# EAGLE design SDLogger (EAGLE 5.10)
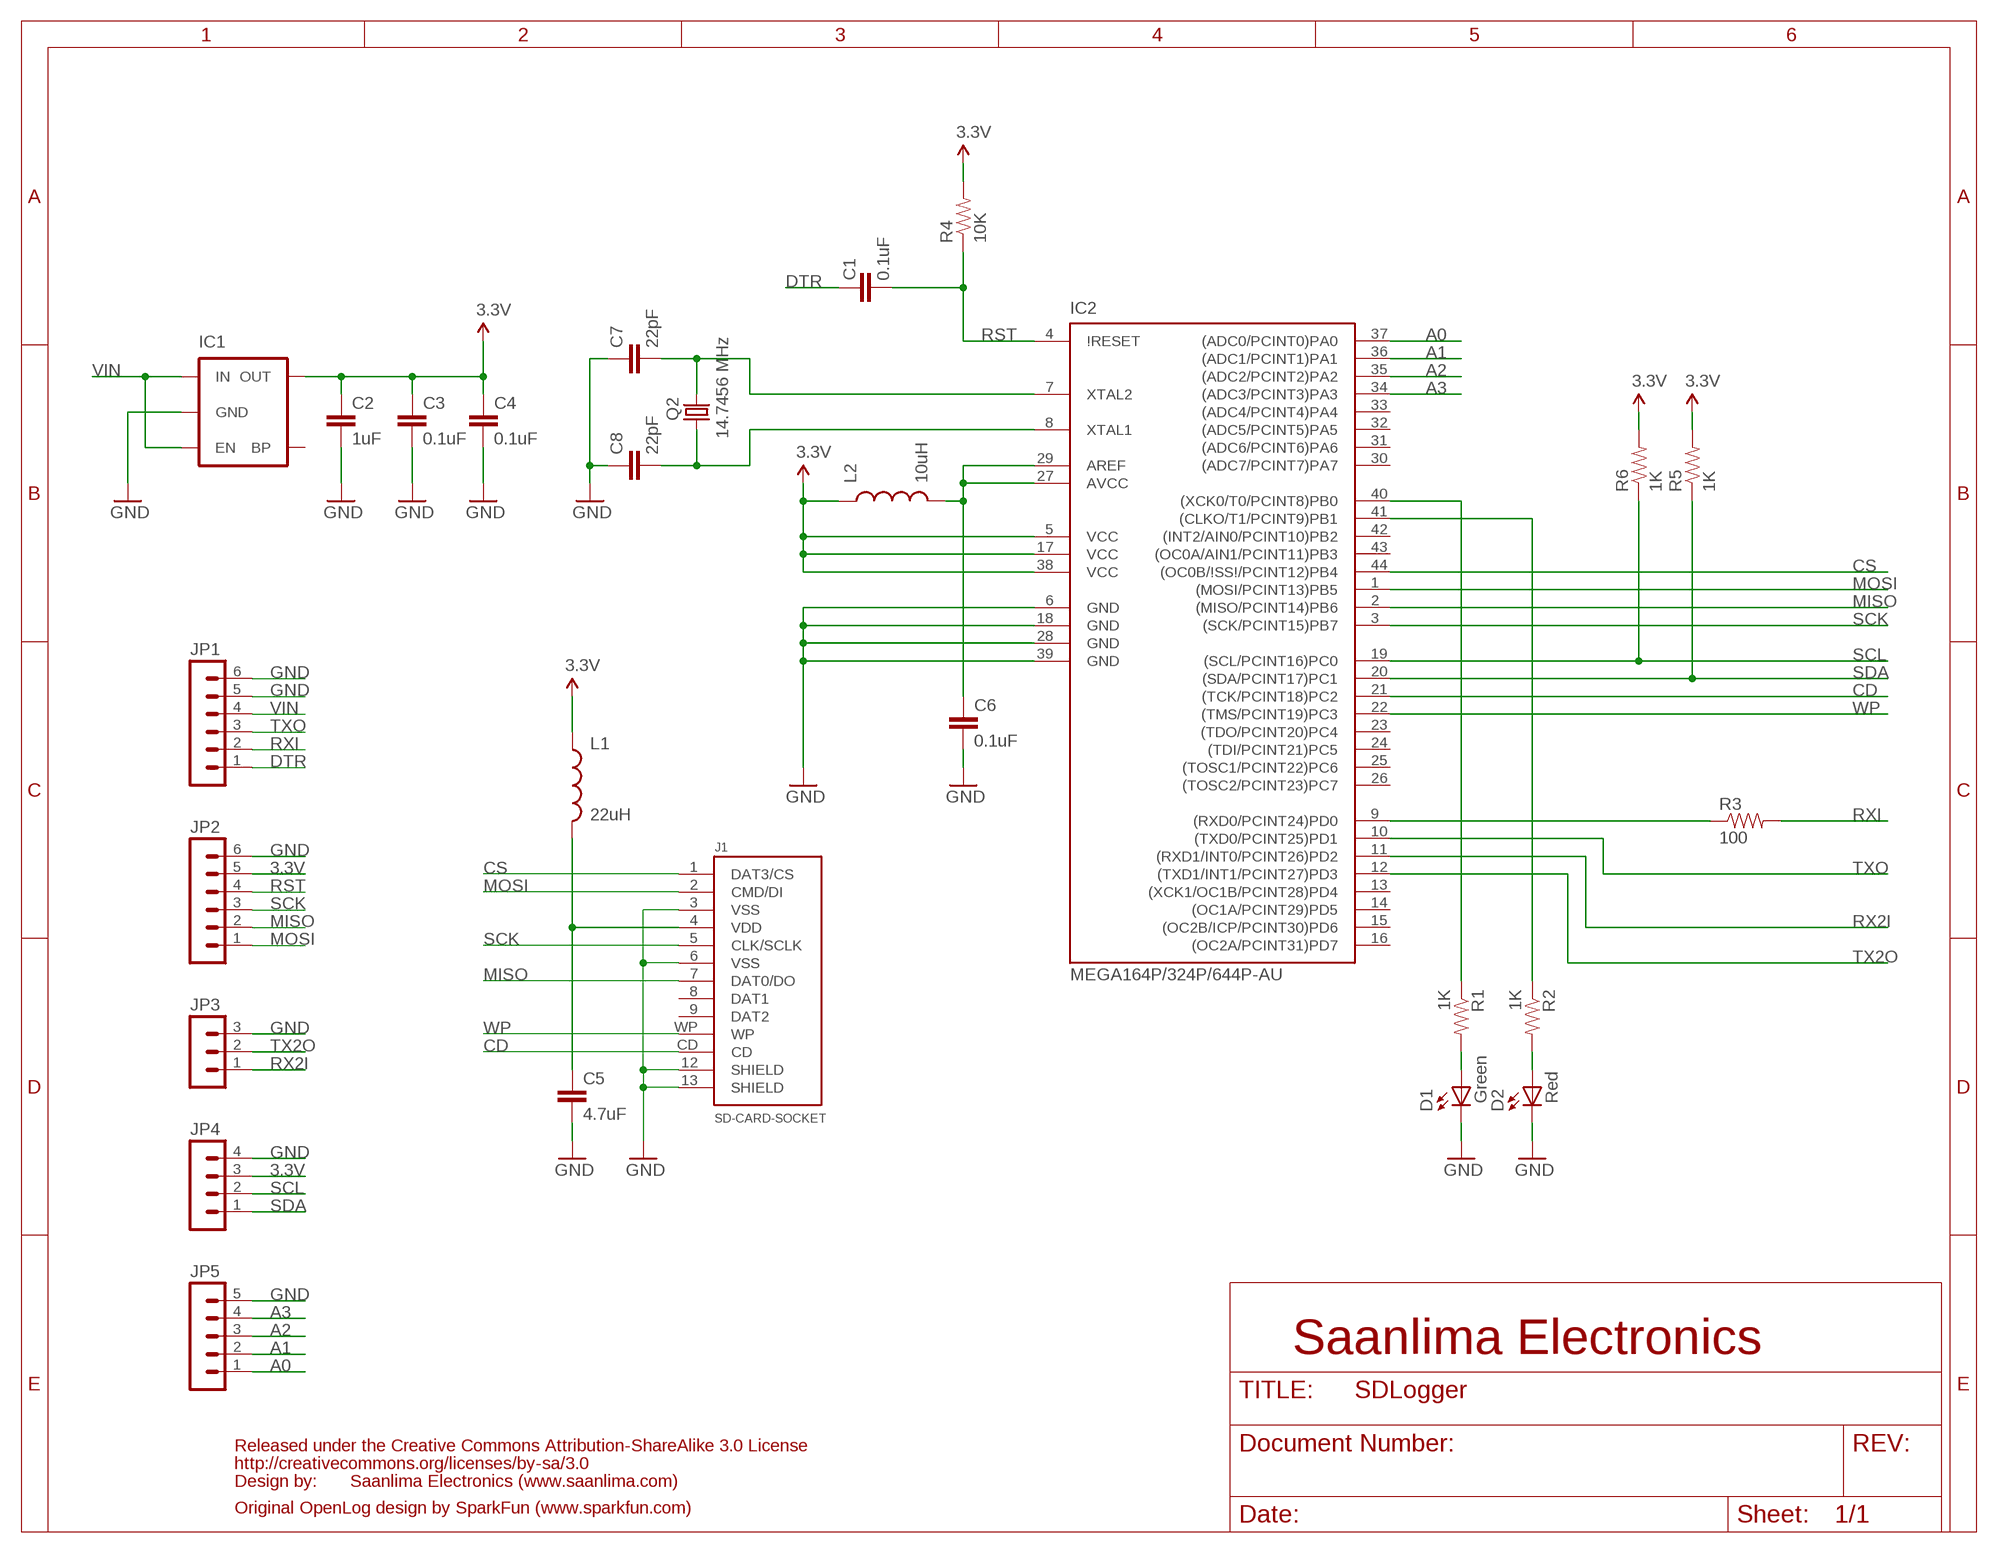
[diagram p0: schematic, sheet 1]

## Parts
C1  0.1uF  CAP0402  [CAP-0402]
C2  1uF  CAP0402  [CAP-0402]
C3  0.1uF  CAP0402  [CAP-0402]
C4  0.1uF  CAP0402  [CAP-0402]
C5  4.7uF  CAP0402  [CAP-0402]
C6  0.1uF  CAP0402  [CAP-0402]
C7  22pF  CAP0402  [CAP-0402]
C8  22pF  CAP0402  [CAP-0402]
D1  Green  LEDCHIPLED_0805  [CHIPLED_0805]
D2  Red  LEDCHIPLED_0805  [CHIPLED_0805]
IC1  3.3V MIC5205  MIC5205SMD  [SOT23-5]
IC2  MEGA164P/324P/644P-AU  [TQFP44]
J1  SD-CARD-SOCKET  [SD-MMC_SOCKET-3M]
JP1  MA06-1  [MA06-1]
JP2  MA06-1  [MA06-1]
JP3  MA03-1  [MA03-1]
JP4  MA04-1  [MA04-1]
JP5  MA05-1  [MA05-1]
L1  22uH  INDUCTOR0805  [IND-0805]
L2  10uH  INDUCTOR0805  [IND-0805]
Q2  14.7456 MHz  CRYSTAL5X3  [CRYSTAL-SMD-5X3]
R1  1K  RESISTOR0402  [RES-0402]
R2  1K  RESISTOR0402  [RES-0402]
R3  100  RESISTOR0402  [RES-0402]
R4  10K  RESISTOR0402  [RES-0402]
R5  1K  RESISTOR0402  [RES-0402]
R6  1K  RESISTOR0402  [RES-0402]
U$1  CC-BY-SA  [CC-BY-SA]

## Nets
3.3V: C2.1 C3.1 C4.1 IC1.5(OUT) IC2.5(VCC) IC2.17(VCC) IC2.38(VCC) JP2.5 JP4.3 L1.1 L2.1 R4.2 R5.2 R6.2
A0: IC2.37((ADC0/PCINT0)PA0) JP5.1
A1: IC2.36((ADC1/PCINT1)PA1) JP5.2
A2: IC2.35((ADC2/PCINT2)PA2) JP5.3
A3: IC2.34((ADC3/PCINT3)PA3) JP5.4
CD: IC2.21((TCK/PCINT18)PC2) J1.CD
CS: IC2.44((OC0B/\!SS\!/PCINT12)PB4) J1.1(DAT3/CS)
DTR: C1.2 JP1.1
GND [vcc]: C2.2 C3.2 C4.2 C5.2 C6.2 C7.1 C8.1 D1.C D2.C IC1.2(GND) IC2.6(GND) IC2.18(GND) IC2.28(GND) IC2.39(GND) J1.3(VSS) J1.6(VSS) J1.12(SHIELD) J1.13(SHIELD) JP1.5 JP1.6 JP2.6 JP3.3 JP4.4 JP5.5
MISO: IC2.2((MISO/PCINT14)PB6) J1.7(DAT0/DO) JP2.2
MOSI: IC2.1((MOSI/PCINT13)PB5) J1.2(CMD/DI) JP2.1
N$1: IC2.9((RXD0/PCINT24)PD0) R3.1
N$2: C8.2 IC2.8(XTAL1) Q2.1
N$3: D1.A R1.2
N$4: IC2.41((CLKO/T1/PCINT9)PB1) R2.1
N$5: IC2.40((XCK0/T0/PCINT8)PB0) R1.1
N$6: C5.1 J1.4(VDD) L1.2
N$7: D2.A R2.2
N$8: C7.2 IC2.7(XTAL2) Q2.3
N$9: C6.1 IC2.27(AVCC) IC2.29(AREF) L2.2
RST: C1.1 IC2.4(\!RESET) JP2.4 R4.1
RX2I: IC2.11((RXD1/INT0/PCINT26)PD2) JP3.1
RXI: JP1.2 R3.2
SCK: IC2.3((SCK/PCINT15)PB7) J1.5(CLK/SCLK) JP2.3
SCL: IC2.19((SCL/PCINT16)PC0) JP4.2 R6.1
SDA: IC2.20((SDA/PCINT17)PC1) JP4.1 R5.1
TX2O: IC2.12((TXD1/INT1/PCINT27)PD3) JP3.2
TXO: IC2.10((TXD0/PCINT25)PD1) JP1.3
VIN [vcc]: IC1.1(IN) IC1.3(EN) JP1.4
WP: IC2.22((TMS/PCINT19)PC3) J1.WP
Unconnected: IC1.4(BP) IC2.13((XCK1/OC1B/PCINT28)PD4) IC2.14((OC1A/PCINT29)PD5) IC2.15((OC2B/ICP/PCINT30)PD6) IC2.16((OC2A/PCINT31)PD7) IC2.23((TDO/PCINT20)PC4) IC2.24((TDI/PCINT21)PC5) IC2.25((TOSC1/PCINT22)PC6) IC2.26((TOSC2/PCINT23)PC7) IC2.30((ADC7/PCINT7)PA7) IC2.31((ADC6/PCINT6)PA6) IC2.32((ADC5/PCINT5)PA5) IC2.33((ADC4/PCINT4)PA4) IC2.42((INT2/AIN0/PCINT10)PB2) IC2.43((OC0A/AIN1/PCINT11)PB3) J1.8(DAT1) J1.9(DAT2)

## Notes on the sheet
- Saanlima Electronics
- Saanlima Electronics (www.saanlima.com)
- Original OpenLog design by SparkFun (www.sparkfun.com)

## Library data of the parts
C1-C8 = rsr:CAP
D1 D2 = led:LED: LED OSRAM: - CHIPLED LG R971, LG N971, LY N971, LG Q971, LY Q971, LO R971, LY R971 LH N974, LH R974 LS Q976, LO Q976, LY Q976 LO Q996 - Hyper CHIPLED LW Q18S LB Q993, LB Q99A, LB R99A - SideLED LS A670, LO A670, LY A670, LG A670, LP A670 LB A673, LV A673, LT A673, LW A673 LH A674 LY A675 LS A676, LA A676, LO A676, LY A676, LW A676 LS A679, LY A679, LG A679 - Hyper Micro SIDELED® LS Y876, LA Y876, LO Y876, LY Y876 LT Y87S - SmartLED LW L88C, LW L88S LB L89C, LB L89S, LG L890 LS L89K, LO L89K, LY L89K LS L896, LA L896, LO L896, LY L896 - TOPLED LS T670, LO T670, LY T670, LG T670, LP T670 LSG T670, LSP T670, LSY T670, LOP T670, LYG T670 LG T671, LOG T671, LSG T671 LB T673, LV T673, LT T673, LW T673 LH T674 LS T676, LA T676, LO T676, LY T676, LB T676, LH T676, LSB T676, LW T676 LB T67C, LV T67C, LT T67C, LS T67K, LO T67K, LY T67K, LW E67C LS E67B, LA E67B, LO E67B, LY E67B, LB E67C, LV E67C, LT E67C LW T67C LS T679, LY T679, LG T679 LS T770, LO T770, LY T770, LG T770, LP T770 LB T773, LV T773, LT T773, LW T773 LH T774 LS E675, LA E675, LY E675, LS T675 LS T776, LA T776, LO T776, LY T776, LB T776 LHGB T686 LT T68C, LB T68C - Hyper Mini TOPLED® LB M676 - Mini TOPLED Santana® LG M470 LS M47K, LO M47K, LY M47K Source: http://www.osram.convergy.de LUXEON: - LUMILED® LXK2-PW12-R00, LXK2-PW12-S00, LXK2-PW14-U00, LXK2-PW14-V00 LXK2-PM12-R00, LXK2-PM12-S00, LXK2-PM14-U00 LXK2-PE12-Q00, LXK2-PE12-R00, LXK2-PE12-S00, LXK2-PE14-T00, LXK2-PE14-U00 LXK2-PB12-K00, LXK2-PB12-L00, LXK2-PB12-M00, LXK2-PB14-N00, LXK2-PB14-P00, LXK2-PB14-Q00 LXK2-PR12-L00, LXK2-PR12-M00, LXK2-PR14-Q00, LXK2-PR14-R00 LXK2-PD12-Q00, LXK2-PD12-R00, LXK2-PD12-S00 LXK2-PH12-R00, LXK2-PH12-S00 LXK2-PL12-P00, LXK2-PL12-Q00, LXK2-PL12-R00 Source: www.luxeon.com KINGBRIGHT: KA-3528ASYC Source: www.kingbright.com
IC1 = rsr:MIC5205: Micrel MIC5205.
IC2 = rsr:MEGA164P/324P/644P-AU
J1 = rsr:SD-CARD-SOCKET
JP1 JP2 = rsr:MA06-1: PIN HEADER
JP3 = rsr:MA03-1: PIN HEADER
JP4 = rsr:MA04-1: PIN HEADER
JP5 = rsr:MA05-1: PIN HEADER
L1 L2 = rsr:INDUCTOR
Q2 = rsr:CRYSTAL
R1-R6 = rsr:RESISTOR
U$1 = rsr:CC-BY-SA

## Net classes
0 default: width 0.178 mm
1 vcc: width 0.203 mm

## Board
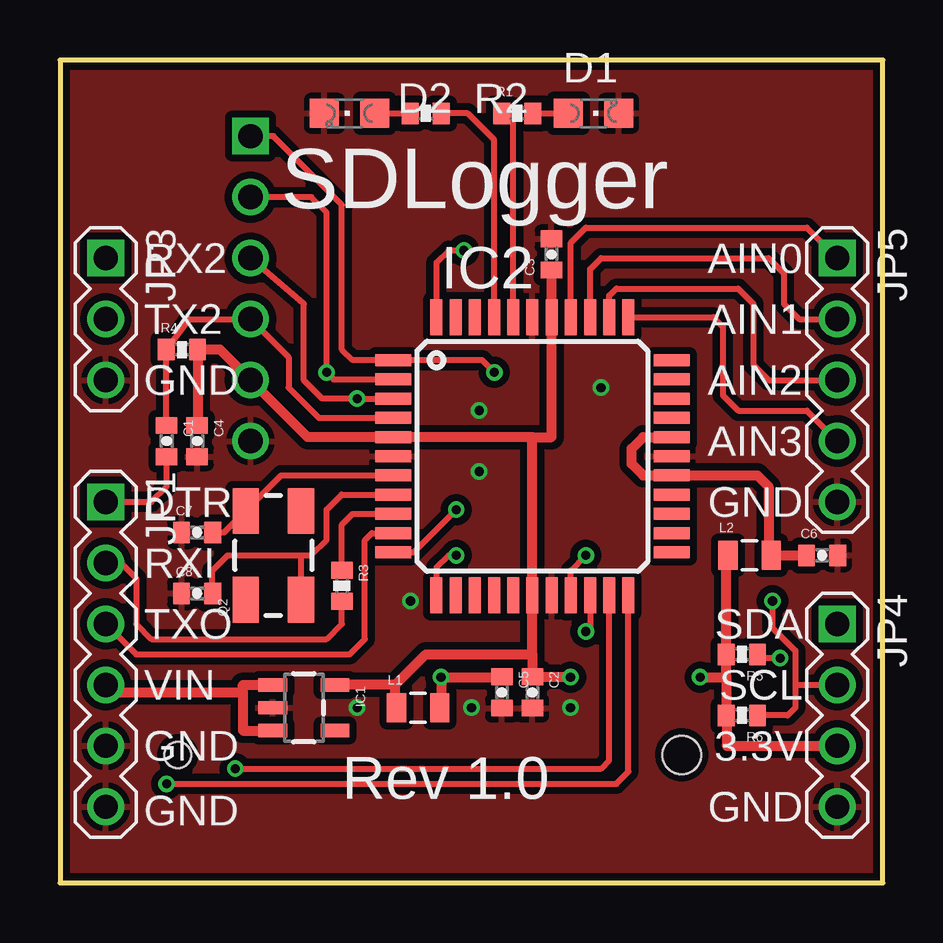
[diagram p1: board, top side]
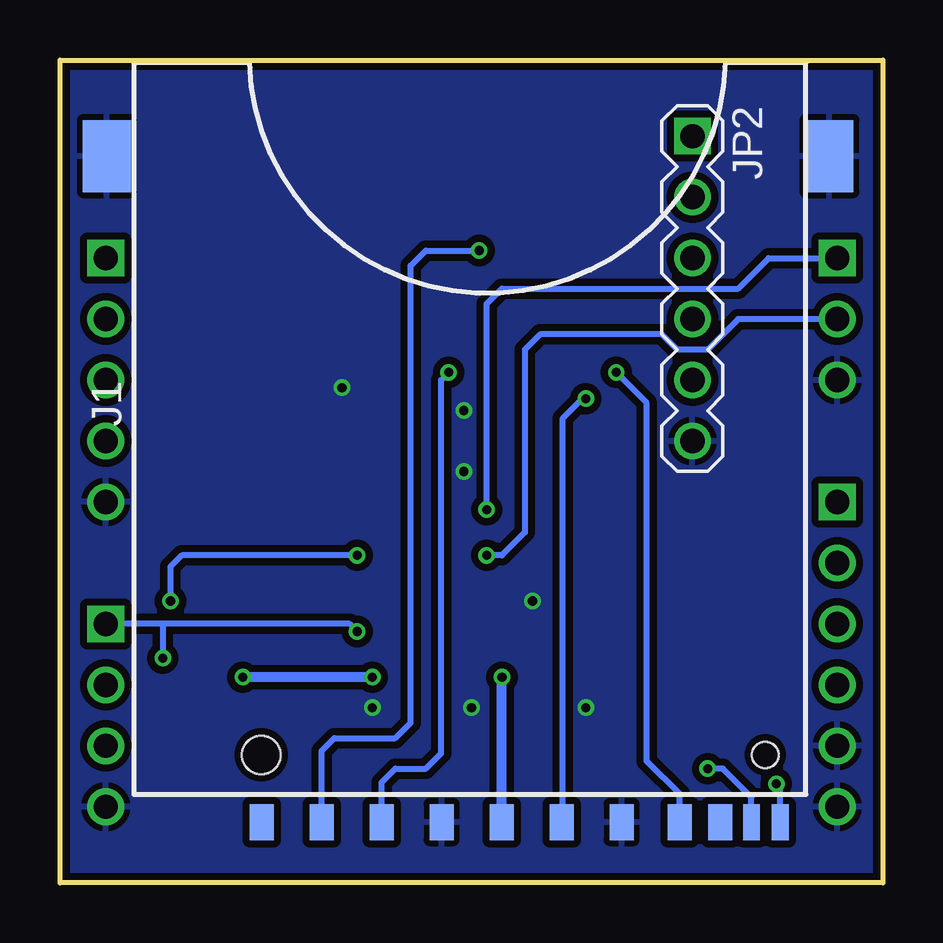
[diagram p2: board, bottom side, seen from below]

Size 34.29 x 34.29 mm. Coordinates in mm from the lower left corner, seen from the top.
Outline: 34.29,0 34.29,34.29 0,34.29 0,0 34.29,0
Copper layers (1*16): Top 0.035mm / dielectric 1.5mm / Bottom 0.035mm
Design rules "Fusion_eagle_rule_v1.1": minimum track width 6mil, minimum drill 12mil, track to track 6mil, track to pad 6mil, pad to pad 6mil, via to via 6mil, smd to smd 0mil, copper to edge 10mil, drill to drill 10mil, minimum pad ring 10mil, minimum via ring 6mil, stop-mask expansion 2mil, vias tented up to drill 100mil, thermal gap 10mil

### Footprints (pad centres in the part's own frame; a part is rotated, then mirrored left to right if it is on the bottom)
CAP-0402 = smd 0.7 x 0.9: 1 -0.65,0; 2 0.65,0
CHIPLED_0805 = smd 1.2 x 1.2: A 0,-1.05; C 0,1.05
SOT23-5 = smd 0.55 x 1.2: 1 -0.95,-1.3; 2 0,-1.3; 3 0.95,-1.3; 4 0.95,1.3; 5 -0.95,1.3
TQFP44 = smd 1.5 x 0.5: 1 -5.8,4; 2 -5.8,3.2; 3 -5.8,2.4; 4 -5.8,1.6; 5 -5.8,0.8; 6 -5.8,0; 7 -5.8,-0.8; 8 -5.8,-1.6; 9 -5.8,-2.4; 10 -5.8,-3.2; 11 -5.8,-4; 23 5.8,-4; 24 5.8,-3.2; 25 5.8,-2.4; 26 5.8,-1.6; 27 5.8,-0.8; 28 5.8,0; 29 5.8,0.8; 30 5.8,1.6; 31 5.8,2.4; 32 5.8,3.2; 33 5.8,4 | smd 0.5 x 1.5: 12 -4,-5.8; 13 -3.2,-5.8; 14 -2.4,-5.8; 15 -1.6,-5.8; 16 -0.8,-5.8; 17 0,-5.8; 18 0.8,-5.8; 19 1.6,-5.8; 20 2.4,-5.8; 21 3.2,-5.8; 22 4,-5.8; 34 4,5.8; 35 3.2,5.8; 36 2.4,5.8; 37 1.6,5.8; 38 0.8,5.8; 39 0,5.8; 40 -0.8,5.8; 41 -1.6,5.8; 42 -2.4,5.8; 43 -3.2,5.8; 44 -4,5.8
SD-MMC_SOCKET-3M = smd 1 x 1.5: 1 6.88,29.85; 2 4.38,29.85; 3 1.88,29.85; 4 -0.62,29.85; 5 -3.12,29.85; 6 -5.62,29.85; 7 -8.04,29.85; 8 -9.728,29.85; 9 9.38,29.85 | smd 2 x 3: 12 -14.28,2.1; 13 15.822,2.095 | smd 0.7 x 1.5: CD -11.03,29.855; WP -12.23,29.85 | hole 1.1: -11.6,27.05 | hole 1.6: 9.4,27.05
MA06-1 = drill 1.016 square: 1 0,0 | drill 1.016 round: 2 2.54,0; 3 5.08,0; 4 7.62,0; 5 10.16,0; 6 12.7,0
MA03-1 = drill 1.016 square: 1 0,0 | drill 1.016 round: 2 2.54,0; 3 5.08,0
MA04-1 = drill 1.016 square: 1 0,0 | drill 1.016 round: 2 2.54,0; 3 5.08,0; 4 7.62,0
MA05-1 = drill 1.016 square: 1 0,0 | drill 1.016 round: 2 2.54,0; 3 5.08,0; 4 7.62,0; 5 10.16,0
IND-0805 = smd 0.8 x 1.2: 1 -0.9,0; 2 0.9,0
CRYSTAL-SMD-5X3 = smd 1.9 x 1.1: 1 -1.85,-1.15; 2 1.85,-1.15; 3 1.85,1.15; 4 -1.85,1.15
RES-0402 = smd 0.7 x 0.9: 1 -0.65,0; 2 0.65,0

### Placement (x,y rotation side)
C1  4.45,18.41 270 top
C2  19.68,7.94 270 top
C3  20.48,26.19 90 top
C4  5.71,18.41 270 top
C5  18.41,7.94 270 top
C6  31.75,13.65 0 top
C7  5.71,14.61 0 top
C8  5.71,12.06 0 top
D1  22.23,32.07 270 top
D2  12.06,32.07 90 top
IC1  10.16,7.3 270 top
IC2  19.68,17.78 0 top
J1  16.51,32.38 180 bottom
JP1  1.91,15.88 270 top
JP2  7.94,31.11 270 bottom
JP3  1.91,26.04 270 top
JP4  32.38,10.79 270 top
JP5  32.38,26.04 270 top
L1  14.92,7.3 0 top
L2  28.73,13.65 0 top
Q2  8.89,13.65 90 top
R1  19.05,32.07 0 top
R2  15.24,32.07 180 top
R3  11.75,12.38 270 top
R4  5.08,22.23 0 top
R5  28.42,9.53 180 top
R6  28.42,6.99 180 top
U$1  -12.7,-6.35 0 top  (outside the outline)

### Tracks (layer width: path | path; a pad name or v marks a point on that pad's centre or on a via)
3.3V  (via drill 0.38)
  Top 0.254: 21.26,8.59 v21.27,8.57
  Top 0.406: 13.97,8.25 IC1.5 | 13.97,8.25 15.24,9.53 19.68,9.53 | 19.68,18.58 IC2.5 10.31,18.58 JP2.5 6.67,22.23 R4.2 5.73,19.08 C4.1 | 19.68,18.58 20.48,18.58 IC2.38 20.48,25.26 C3.1 | 19.68,18.58 IC2.17 19.68,9.53 | 21.26,8.59 C2.1 19.68,9.53 | L1.1 13.97,7.36 13.97,8.25 | JP4.3 27.78,5.71 R6.2 27.77,8.57 | 27.77,8.57 R5.2 | R5.2 | R5.2 27.77,13.65 L2.1 | v26.67,8.57 27.77,8.57
  Bottom 0.406: v21.27,8.57 v26.67,8.57
A0
  Top 0.254: IC2.37 21.29,26.68 21.91,27.3 31.11,27.3 JP5.1
A1
  Top 0.254: IC2.36 22.09,25.58 22.54,26.04 29.53,26.04 30.16,25.4 30.16,24.13 30.8,23.5 JP5.2
A2
  Top 0.254: IC2.35 22.89,24.47 23.18,24.77 28.26,24.77 28.89,24.13 28.89,21.59 29.53,20.95 JP5.3
A3
  Top 0.254: IC2.34 27.22,23.58 27.62,23.18 27.62,20.32 28.26,19.68 31.11,19.68 JP5.4
CD  (via drill 0.38)
  Top 0.254: IC2.21 22.89,5.11 22.54,4.76 v7.3,4.76
  Bottom 0.254: J1.CD 5.48,3.58 6.67,4.76 v7.3,4.76
CS  (via drill 0.38)
  Top 0.254: IC2.44 15.69,25.84 16.19,26.35 v16.83,26.35
  Bottom 0.254: v16.83,26.35 19.05,26.35 19.68,25.72 19.68,6.67 20.32,6.03 22.86,6.03 23.39,5.5 J1.1
DTR
  Top 0.254: JP1.1 3.81,15.88 4.45,16.51 C1.2
GND  (via drill 0.38)
  other vias: 22.54,20.64 17.14,7.3 12.38,7.3 17.46,19.68 21.27,7.3 14.61,11.75 17.46,17.14
  pour Top (isolate 0.305): 34.29,0 0,0 0,34.29 34.29,34.29
  pour Bottom (isolate 0.305): 34.29,0 0,0 0,34.29 34.29,34.29
MISO  (via drill 0.38)
  Top 0.254: JP2.2 10.48,28.57 11.11,27.94 v11.11,21.27 11.4,20.98 IC2.2
  Bottom 0.254: J1.7 8.47,3.71 9.84,5.08 9.84,20 v11.11,21.27
MOSI  (via drill 0.38)
  Top 0.254: v18.1,21.27 17.59,21.78 IC2.1 12.19,21.78 11.75,22.23 11.75,28.26 8.89,31.11 JP2.1
  Bottom 0.254: v18.1,21.27 18.41,20.95 18.41,5.4 19.05,4.76 20.32,4.76 20.89,4.19 J1.2
N$1
  Top 0.254: IC2.9 12.21,15.38 11.75,14.92 R3.1
N$2
  Top 0.254: IC2.8 11.73,16.18 11.11,15.56 11.11,14.29 10.48,13.65 10.04,13.65 | C8.2 6.35,12.08 6.35,13.02 6.99,13.65 10.04,13.65 | 10.36,12.5 Q2.1 10.04,13.65
N$3
  Top 0.254: R1.2 D1.A
N$4
  Top 0.254: IC2.41 18.09,30.97 16.99,32.07 R2.1
N$5
  Top 0.254: IC2.40 18.89,31.59 18.73,32.07 R1.1
N$6  (via drill 0.38)
  Top 0.254: 18.1,8.57 C5.1
  Top 0.406: L1.2 15.88,7.3 v15.88,8.57 18.1,8.57
  Bottom 0.254: v15.89,8.57 v15.88,8.57
  Bottom 0.406: J1.4 v15.89,8.57
N$7
  Top 0.203: D2.A 13.34,32.07
  Top 0.254: 13.34,32.07 R2.2
N$8
  Top 0.254: Q2.3 7.9,15.82 | IC2.7 9.22,16.98 Q2.3 | C7.2 6.84,14.61 Q2.3
N$9
  Top 0.254: L2.2 29.53,13.71 29.58,13.65
  Top 0.406: 29.53,13.71 29.53,16.51 29.06,16.98 IC2.27 24.3,16.98 23.81,17.46 23.81,18.1 24.3,18.58 IC2.29 | 29.58,13.65 C6.1
RST
  Top 0.254: IC2.4 10.78,19.38 9.53,20.64 9.53,21.91 JP2.4 5.38,23.5 R4.1 4.43,19.4 C1.1
RX2I  (via drill 0.38)
  Top 0.254: IC2.11 14.73,13.78 v16.51,15.56
  Bottom 0.254: v16.51,15.56 16.51,24.13 15.88,24.77 6.03,24.77 4.76,26.04 JP3.1
RXI
  Top 0.254: JP1.2 2.54,13.34 3.17,12.7 3.17,10.79 3.81,10.16 11.11,10.16 11.75,10.79 R3.2
SCK  (via drill 0.38)
  Top 0.254: IC2.3 v12.38,20.18 10.94,20.18 10.16,20.95 10.16,24.13 JP2.3
  Bottom 0.254: J1.5 13.34,2.59 13.34,19.37 12.52,20.18 v12.38,20.18
SCL  (via drill 0.38)
  Top 0.254: IC2.19 21.29,13.01 21.27,13.02 v21.91,13.65 | 30.64,8.26 JP4.2 | v29.69,11.75 29.69,10.64 30.64,9.68 30.64,8.26 | R6.1 30.32,6.99 30.64,7.3 30.64,8.26
  Bottom 0.254: v21.91,13.65 29.21,13.65 29.69,13.18 v29.69,11.75
SDA  (via drill 0.38)
  Top 0.254: IC2.20 22.09,10.65 v21.91,10.48 | R5.1 29.05,9.51 29.07,9.51 29.21,9.37 v30,9.37
  Bottom 0.254: 30,10.79 22.23,10.79 v21.91,10.48 | 30,10.79 JP4.1 | 30,10.79 v30,9.37
TX2O  (via drill 0.38)
  Top 0.254: IC2.12 15.69,13.14 16.19,13.65 v16.51,13.65
  Bottom 0.254: v16.51,13.65 15.88,13.65 14.92,14.61 14.92,22.23 14.29,22.86 9.21,22.86 8.57,22.23 7.3,22.23 6.03,23.5 JP3.2
TXO
  Top 0.254: IC2.10 12.99,14.58 12.7,14.29 12.7,10.16 12.06,9.53 3.17,9.53 JP1.3
VIN
  Top 0.406: JP1.4 2.22,7.94 7.62,7.94 | 7.62,7.94 7.62,8.26 8.22,8.26 IC1.1 | IC1.3 7.62,6.35 7.62,7.94
WP  (via drill 0.38)
  Top 0.254: IC2.22 23.68,4.63 23.18,4.13 v4.45,4.13
  Bottom 0.254: J1.WP 4.28,3.98 v4.45,4.13

### Text on the board
tPlace: SDLogger | AIN0 | RX2 | AIN1 | TX2 | AIN2 | GND | AIN3 | GND | DTR | RXI | SDA | TXO | SCL | VIN | 3.3V | GND | GND | Rev 1.0 | GND
tDocu: Saanlima Electronics (www.saanlima.com) | Original OpenLog design by SparkFun (www.sparkfun.com)